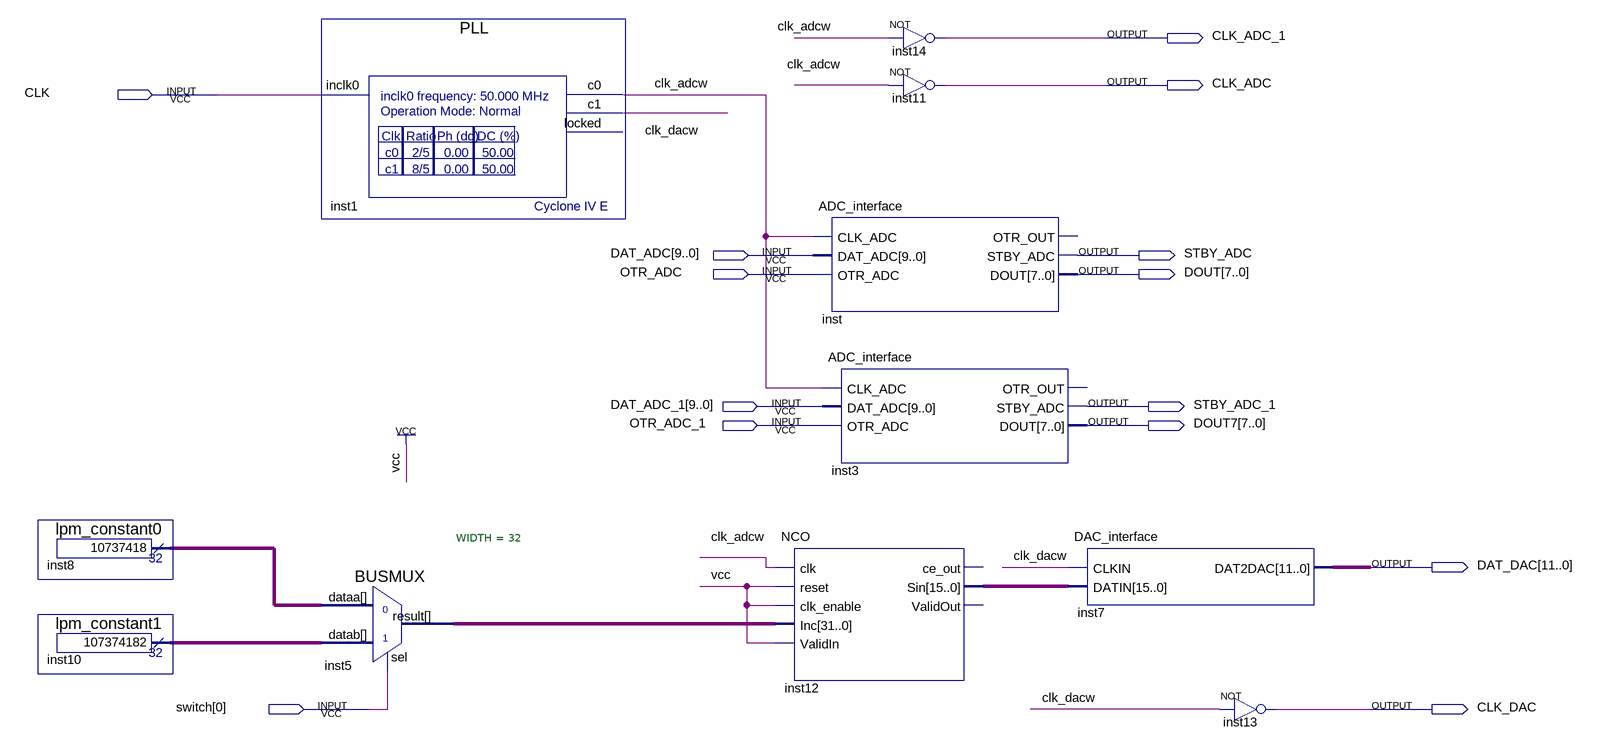
[diagram p0: schematic sheet]
// Quartus schematic adcdac_test.bdf as structural Verilog: 11 symbols, 14 pins
module adcdac_test (
  input  CLK,
  input  [9:0] DAT_ADC,
  input  OTR_ADC,
  input  [9:0] DAT_ADC_1,
  input  OTR_ADC_1,
  input  [0:0] switch,
  output CLK_ADC_1,
  output CLK_ADC,
  output STBY_ADC,
  output [7:0] DOUT,
  output STBY_ADC_1,
  output [7:0] DOUT7,
  output [11:0] DAT_DAC,
  output CLK_DAC
);

  wire clk_adcw, clk_dacw;
  wire [15:0] inst12_sin;
  wire [31:0] inst5_result, inst8_result, inst10_result;

  lpm_constant0 inst8 (.result(inst8_result));
  lpm_constant1 inst10 (.result(inst10_result));
  PLL inst1 (.inclk0(CLK), .c0(clk_adcw), .c1(clk_dacw));  // open: locked
  BUSMUX #(.WIDTH(32)) inst5 (.datab(inst10_result), .sel(switch[0]), .dataa(inst8_result), .result(inst5_result));
  NCO inst12 (
    .clk(clk_adcw), .reset(1'b1), .clk_enable(1'b1), .Inc(inst5_result), .ValidIn(1'b1), .Sin(inst12_sin));  // open: ce_out, ValidOut
  ADC_interface inst (
    .CLK_ADC(clk_adcw), .DAT_ADC(DAT_ADC), .OTR_ADC(OTR_ADC), .STBY_ADC(STBY_ADC), .DOUT(DOUT));  // open: OTR_OUT
  ADC_interface inst3 (
    .CLK_ADC(clk_adcw), .DAT_ADC(DAT_ADC_1), .OTR_ADC(OTR_ADC_1), .STBY_ADC(STBY_ADC_1), .DOUT(DOUT7));  // open: OTR_OUT
  not inst14 (CLK_ADC_1, clk_adcw);
  not inst11 (CLK_ADC, clk_adcw);
  DAC_interface inst7 (.CLKIN(clk_dacw), .DATIN(inst12_sin), .DAT2DAC(DAT_DAC));
  not inst13 (CLK_DAC, clk_dacw);
endmodule
